# EAGLE schematic MotorControl (EAGLE 9.4.2)
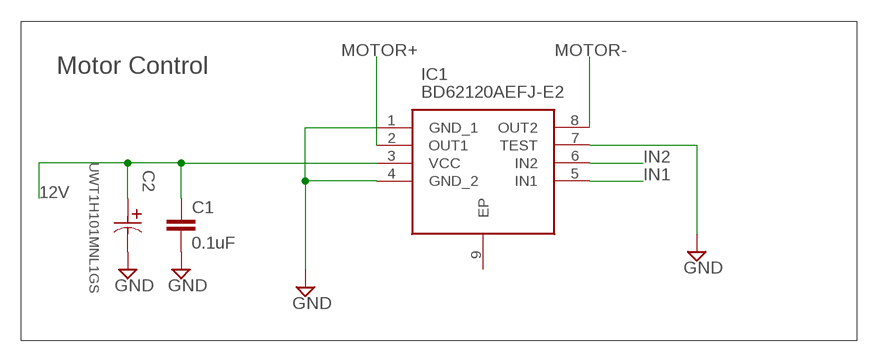
[diagram p0: schematic, sheet 1]

## Parts
C1  0.1uF  C-EUC0402  [C0402]
C2  UWT1H101MNL1GS  [PCAP_8X10-ELECT]
IC1  BD62120AEFJ-E2  [SOIC127P600X100-9N]

## Nets
12V: C1.1 C2.1 IC1.3(VCC)
GND: C1.2 C2.2 IC1.1(GND_1) IC1.4(GND_2) IC1.7(TEST)
IN1: IC1.5(IN1)
IN2: IC1.6(IN2)
MOTOR+: IC1.2(OUT1)
MOTOR-: IC1.8(OUT2)
Unconnected: IC1.9(EP)

## Notes on the sheet
- Motor Control

## Library data of the parts
C1 = rcl:C-EU: CAPACITOR, European symbol; SPICEPREFIX: C
C2 = UWT1H101MNL1GS:UWT1H101MNL1GS; BUILT_BY: EMA_UL_Team; MANUFACTURER_PART_NUMBER: UWT1H101MNL1GS; VENDOR: Nichicon
IC1 = SamacSys_Parts:BD62120AEFJ-E2: ROHM BD62120AEFJ-E2 Motor Driver IC 8-Pin, HTSOP-J Source: Datasheet <https://componentsearchengine.com/Datasheets/1/BD62120AEFJ-E2.pdf>; DESCRIPTION: ROHM BD62120AEFJ-E2 Motor Driver IC 8-Pin, HTSOP-J; HEIGHT: 1mm; MANUFACTURER_NAME: ROHM Semiconductor; MANUFACTURER_PART_NUMBER: BD62120AEFJ-E2; MOUSER_PART_NUMBER: 755-BD62120AEFJ-E2; MOUSER_PRICE-STOCK: https://www.mouser.com/Search/Refine.aspx?Keyword=755-BD62120AEFJ-E2